# EAGLE schematic untitled (EAGLE 7.6.0)
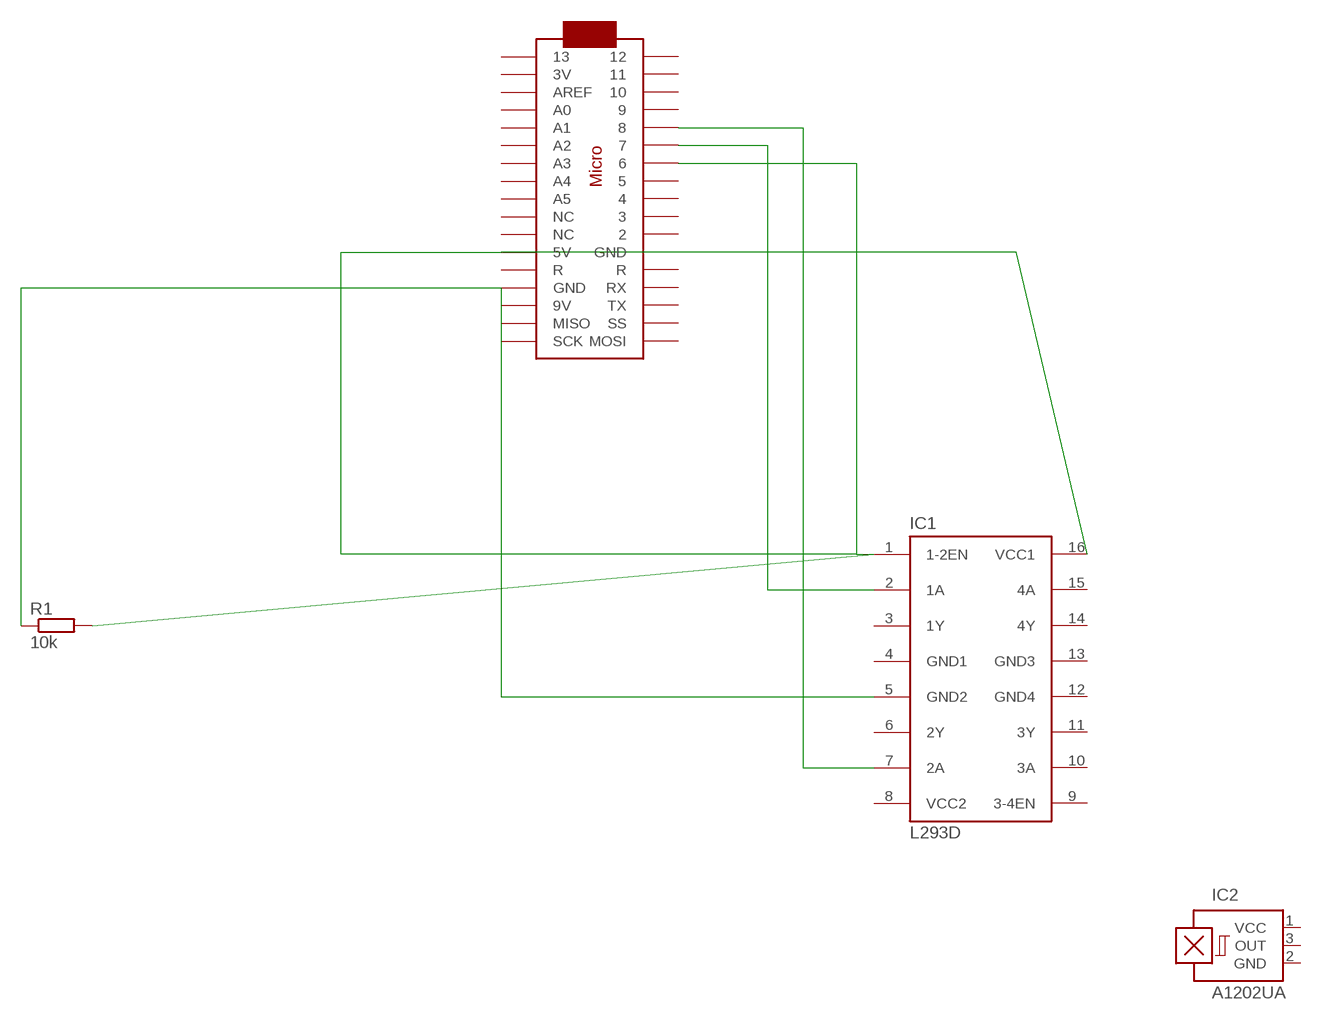
[diagram p0: schematic, sheet 1]

## Parts
IC1  L293D  [DIL16]
IC2  A1202UA  [SIP3-UA]
R1  10k  R-EU_0207/10  [0207/10]
U$1  ARDUINOMICRO  [ARDUINOMICRO]

## Nets
N$1: IC1.1(1-2EN) IC1.16(VCC1) R1.2 U$1.P$7 U$1.P$23(5V)
N$2: IC1.5(GND2) R1.1 U$1.P$12(GND)
N$3: IC1.2(1A) U$1.P$6
N$4: IC1.7(2A) U$1.P$5
Unconnected: IC1.3(1Y) IC1.6(2Y) IC1.9(3-4EN) IC1.10(3A) IC1.11(3Y) IC1.14(4Y) IC1.15(4A) IC2.3(OUT) U$1.P$1 U$1.P$2 U$1.P$3 U$1.P$4 U$1.P$8 U$1.P$9 U$1.P$10 U$1.P$11 U$1.P$13(R) U$1.P$14(RX) U$1.P$15(TX) U$1.P$16(SS) U$1.P$17(MOSI) U$1.P$18(SCK) U$1.P$19(MISO) U$1.P$20(9V) U$1.P$21(GND) U$1.P$22(R) U$1.P$24(NC) U$1.P$25(NC) U$1.P$26(A5) U$1.P$27(A4) U$1.P$28(A3) U$1.P$29(A2) U$1.P$30(A1) U$1.P$31(A0) U$1.P$32(AREF) U$1.P$33(3V) U$1.P$34

## Power pins joined to a net without a drawn wire
GND: IC2.2(GND)
GND1: IC1.4(GND1)
GND3: IC1.13(GND3)
GND4: IC1.12(GND4)
VCC: IC2.1(VCC)
VCC2: IC1.8(VCC2)

## Library data of the parts
IC1 = st-microelectronics:L293D: PUSH-PULL 4 CHANNEL DRIVER; MF: TEXAS INSTRUMENTS; MPN: L293DNEE4; OC_FARNELL: 9589619; OC_NEWARK: 56P8249
IC2 = allegro:A12*?: Hall-effect bipolar switch Source: http://www.allegromicro.com/en/Products/Part_Numbers/1202/1202.pdf; OC_FARNELL: unknown; OC_NEWARK: unknown
R1 = resistor:R-EU_: RESISTOR, European symbol; MF: TE CONNECTIVITY; MPN: CFR16J10K; OC_FARNELL: 2329474
U$1 = adafruit:ARDUINOMICRO; MF: ARDUINO; MPN: A000093; OC_FARNELL: 2285196

## Module ARDUINO
Ports: PINARMPOS0(io)

### Library data of the parts